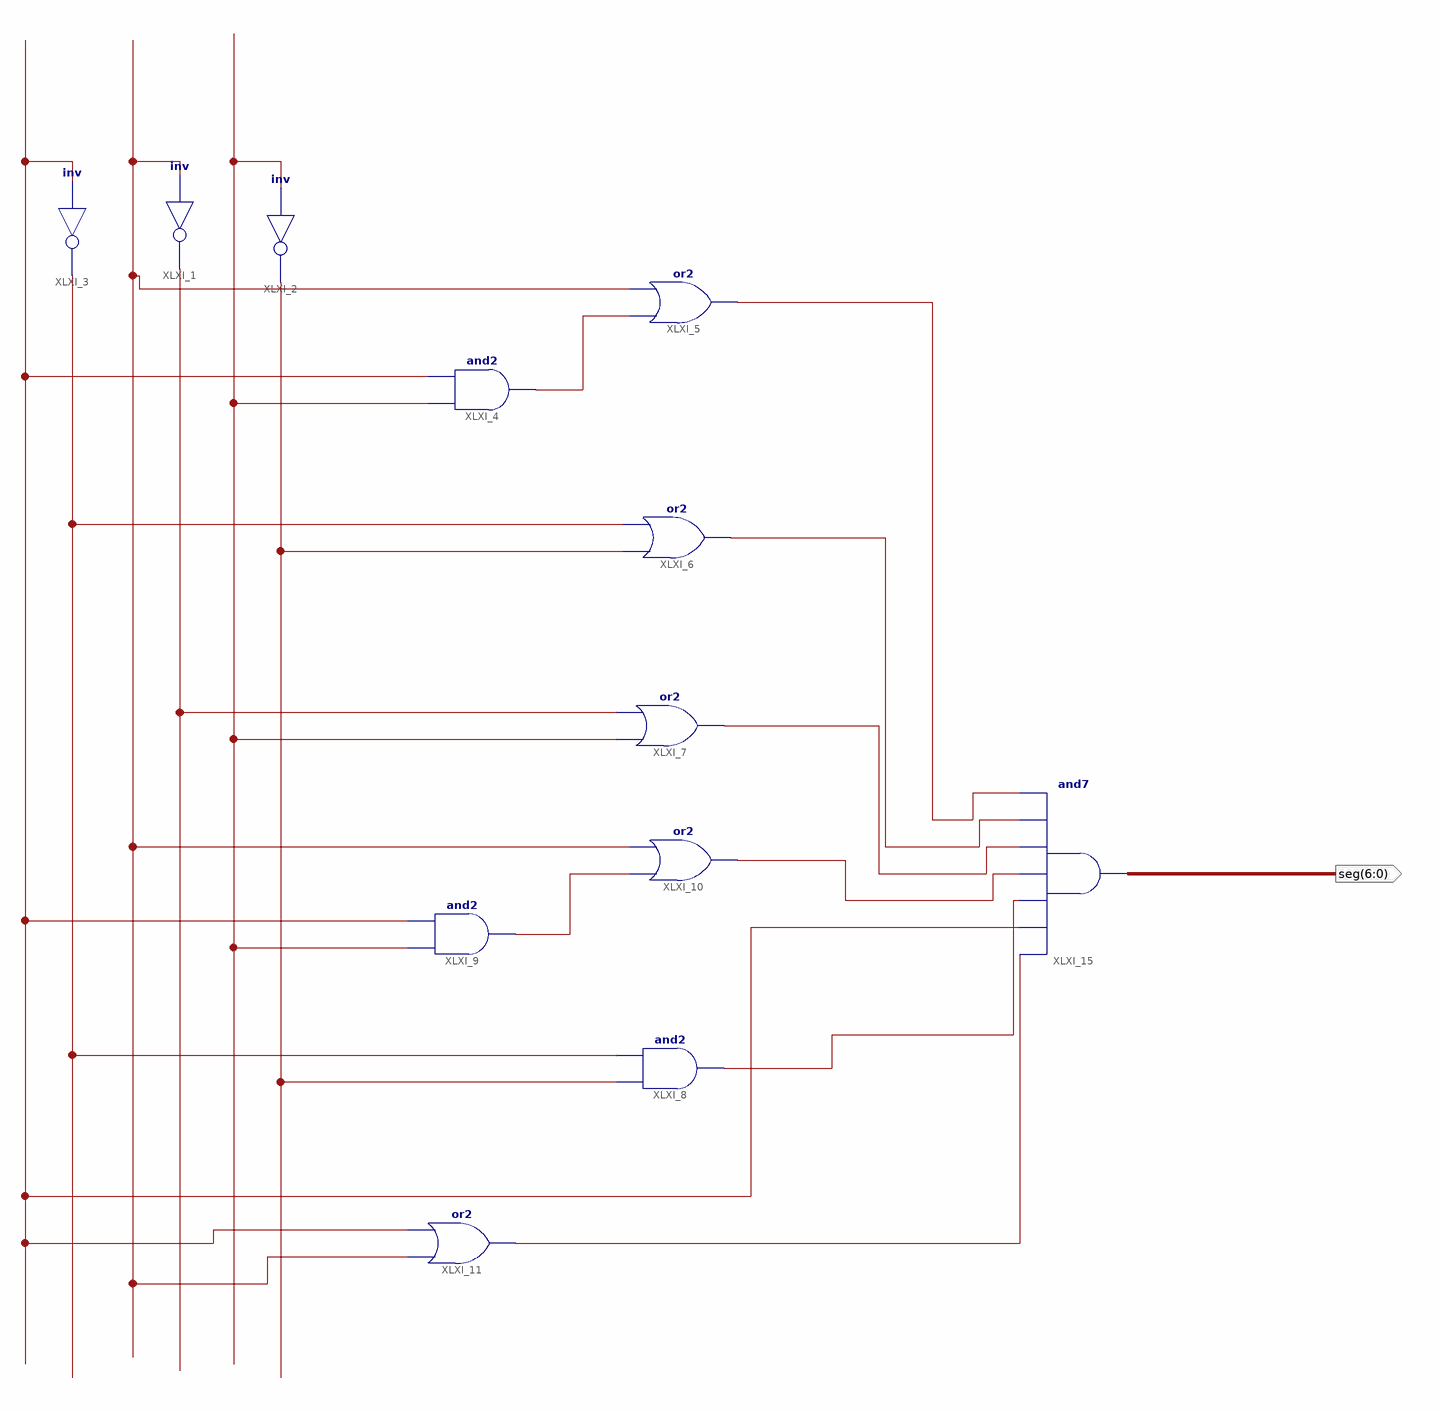
[diagram p0: schematic sheet 1]
// Xilinx ISE schematic BCDTS.sch (spartan6) as structural Verilog: 12 symbols, 1 ports
module BCDTS (
  output [6:0] seg
);

  wire a, b, c, d, e, g, x, XLXN_2, XLXN_3, XLXN_4, XLXN_6, XLXN_7, y, z;

  not XLXI_1 (XLXN_3, y);
  not XLXI_2 (XLXN_4, z);
  not XLXI_3 (XLXN_2, x);
  and XLXI_4 (XLXN_6, z, x);
  or XLXI_5 (a, XLXN_6, y);
  or XLXI_6 (b, XLXN_4, XLXN_2);
  or XLXI_7 (c, z, XLXN_3);
  and XLXI_8 (e, XLXN_4, XLXN_2);
  and XLXI_9 (XLXN_7, z, x);
  or XLXI_10 (d, XLXN_7, y);
  or XLXI_11 (g, y, x);
  assign seg = {7{g}} & {7{x}} & {7{e}} & {7{d}} & {7{c}} & {7{b}} & {7{a}};  // and7 XLXI_15, 7 bits wide
endmodule
